# EAGLE design PiSpi (EAGLE 6.4)
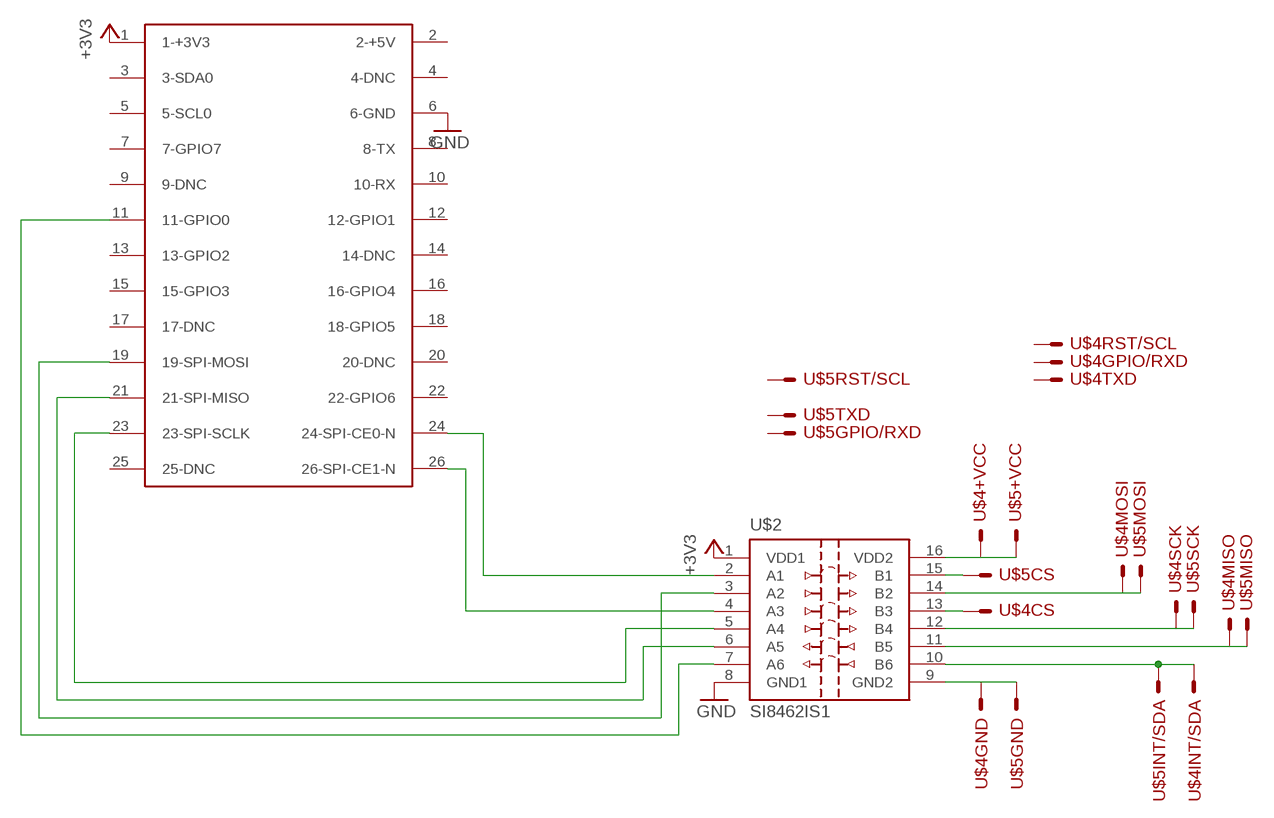
[diagram p0: schematic, sheet 1]

## Parts
U$1  RASPBERRY-PI  [RASPBERRY-PI]
U$2  SI8462IS1  [SO16]
U$4  SPI_BUS2  [SPI_BUS2]
U$5  SPI_BUS2  [SPI_BUS2]

## Nets
+3V3: U$1.1(1-+3V3) U$2.1(VDD1)
GND: U$1.6(6-GND) U$2.8(GND1)
GND1: U$2.9(GND2) U$4.GND U$5.GND
N$1: U$1.24(24-SPI-CE0-N) U$2.2(A1)
N$2: U$2.14(B2) U$4.MOSI U$5.MOSI
N$3: U$2.13(B3) U$4.CS
N$4: U$2.12(B4) U$4.SCK U$5.SCK
N$5: U$2.11(B5) U$4.MISO U$5.MISO
N$6: U$2.15(B1) U$5.CS
N$7: U$1.11(11-GPIO0) U$2.7(A6)
N$8: U$2.10(B6) U$4.INT/SDA U$5.INT/SDA
N$15: U$1.26(26-SPI-CE1-N) U$2.4(A3)
N$17: U$1.23(23-SPI-SCLK) U$2.5(A4)
N$18: U$1.21(21-SPI-MISO) U$2.6(A5)
N$19: U$1.19(19-SPI-MOSI) U$2.3(A2)
N$32: U$2.16(VDD2) U$4.+VCC U$5.+VCC
Unconnected: U$1.2(2-+5V) U$1.3(3-SDA0) U$1.4(4-DNC) U$1.5(5-SCL0) U$1.7(7-GPIO7) U$1.8(8-TX) U$1.9(9-DNC) U$1.10(10-RX) U$1.12(12-GPIO1) U$1.13(13-GPIO2) U$1.14(14-DNC) U$1.15(15-GPIO3) U$1.16(16-GPIO4) U$1.17(17-DNC) U$1.18(18-GPIO5) U$1.20(20-DNC) U$1.22(22-GPIO6) U$1.25(25-DNC) U$4.GPIO/RXD U$4.RST/SCL U$4.TXD U$5.GPIO/RXD U$5.RST/SCL U$5.TXD

## Library data of the parts
U$1 = lieven:RASPBERRY-PI: Raspberry Pi Board <http://www.raspberrypi.org/> Jacques Lagnel V1.0 (beta) 2012 Board dimension: Forum 3D model <http://www.raspberrypi.org/forum/general-discussion/mechanical-profile-3d-models?value=3d%20model&type=1&include=1&search=1&ret=all> The GPIO Connector (P1): http://elinux.org/RPi_Low-level_peripherals
U$2 = silicon-labs:SI8462: Si8462 6 Channel (4/2) Digital Isolator Silicon Labs Si84xx ISOpro digital isolator series. The Si84xx ISOpro digital isolators provide low power galvanic isolation for digital signals. They come in speeds of 1Mbps and 150Mbps, and isolation ratings of 1KV, 2.5KV and 5KV. The independent sides use 2.7-5.5V supplies and draw under 5mA per channel. Donald Becker
U$4 U$5 = lieven:SPI_BUS2

## Board
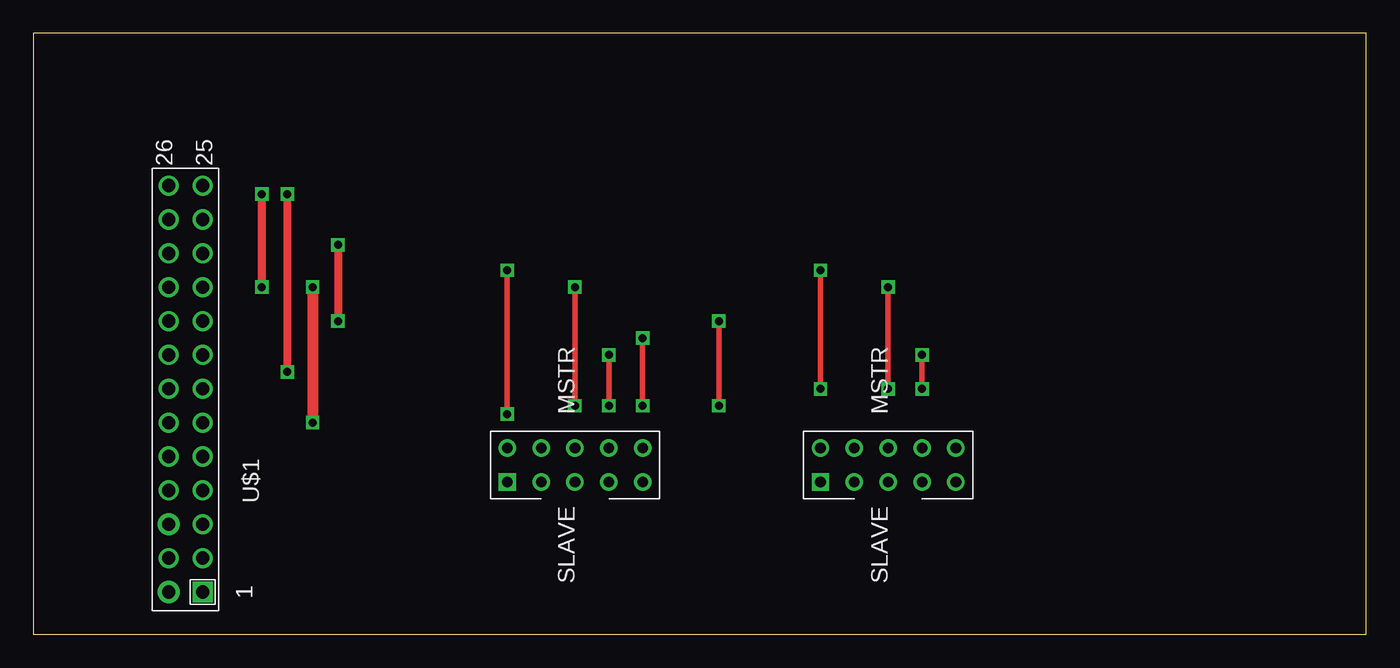
[diagram p1: board, top side]
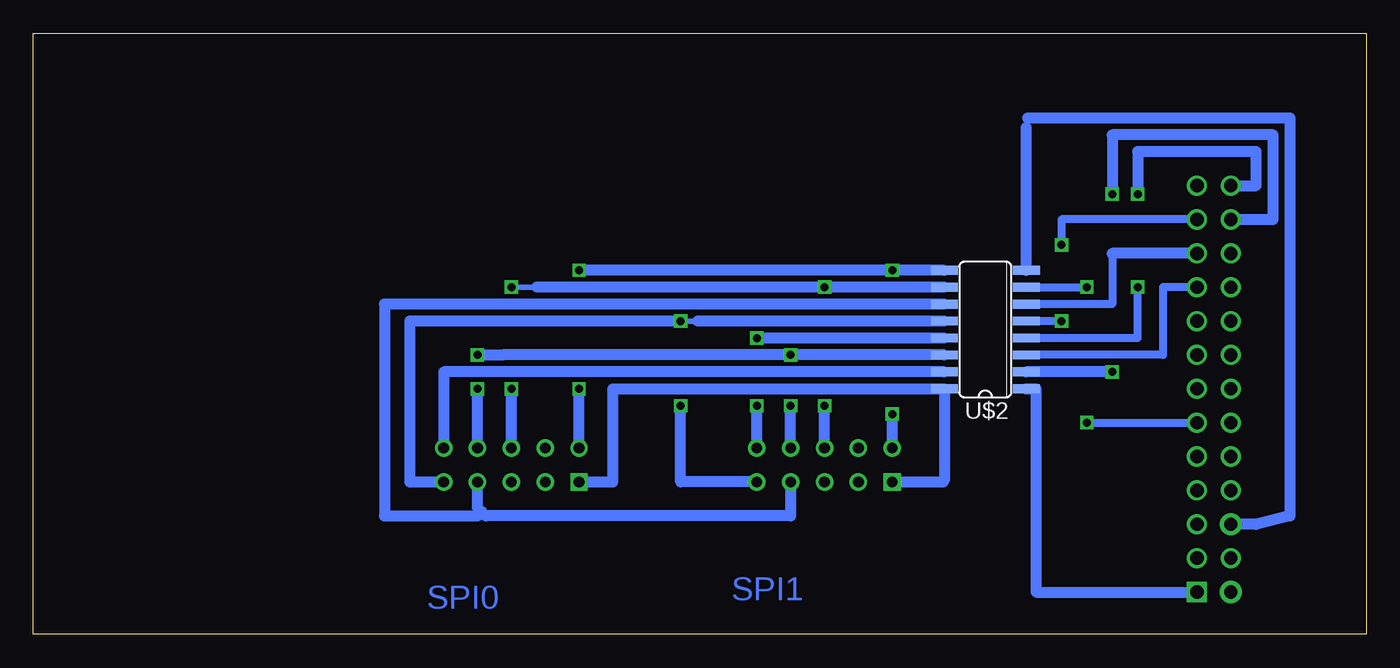
[diagram p2: board, bottom side, seen from below]

Size 100 x 45.08 mm. Coordinates in mm from the lower left corner, seen from the top.
Outline: 0,0 100,0 100,45.08 0,45.08 0,0
Copper layers (1*16): Top 0.035mm / dielectric 1.5mm / Bottom 0.035mm
Design rules "default": minimum track width 10mil, minimum drill 24mil, track to track 8mil, track to pad 8mil, pad to pad 8mil, via to via 8mil, smd to smd 8mil, copper to edge 40mil, drill to drill 8mil, minimum pad ring 10mil, minimum via ring 8mil, stop-mask expansion 4mil, vias tented up to drill 0mil, thermal gap 10mil

### Footprints (pad centres in the part's own frame; a part is rotated, then mirrored left to right if it is on the bottom)
RASPBERRY-PI = drill 1 square: 1 0,0 | drill 1 pad 1.676: 2 0,2.54; 6 5.08,2.54 | drill 1: 3 2.54,0; 4 2.54,2.54; 5 5.08,0; 7 7.62,0; 8 7.62,2.54; 9 10.16,0; 10 10.16,2.54; 11 12.7,0; 12 12.7,2.54; 13 15.24,0; 14 15.24,2.54; 15 17.78,0; 16 17.78,2.54; 17 20.32,0; 18 20.32,2.54; 19 22.86,0; 20 22.86,2.54; 21 25.4,0; 22 25.4,2.54; 23 27.94,0; 24 27.94,2.54; 25 30.48,0; 26 30.48,2.54
SO16 = smd 0.66 x 2.032: 1 -4.445,-3.073; 2 -3.175,-3.073; 3 -1.905,-3.073; 4 -0.635,-3.073; 5 0.635,-3.073; 6 1.905,-3.073; 7 3.175,-3.073; 8 4.445,-3.073; 9 4.445,3.073; 10 3.175,3.073; 11 1.905,3.073; 12 0.635,3.073; 13 -0.635,3.073; 14 -1.905,3.073; 15 -3.175,3.073; 16 -4.445,3.073
SPI_BUS2 = drill 0.8 square: +VCC 0,10.16 | drill 0.8: CS 2.54,0; GND 2.54,10.16; GPIO/RXD 2.54,7.62; INT/SDA 2.54,5.08; MISO 0,2.54; MOSI 2.54,2.54; RST/SCL 0,5.08; SCK 0,0; TXD 0,7.62

### Placement (x,y rotation side)
U$1  12.7,3.17 90 top
U$2  28.57,22.86 90 bottom
U$4  45.72,11.43 90 top
U$5  69.22,11.43 90 top

### Tracks (layer width: path | path; a pad name or v marks a point on that pad's centre or on a via)
+3V3
  Bottom 0.813: U$2.1 24.77,18.41 24.77,3.17 U$1.1
GND
  Bottom 0.406: 25.5,38 25.4,38.73
  Bottom 0.813: U$2.8 25.5,38 | 25.4,38.73 5.71,38.73 5.71,8.89 8.26,8.26 U$1.6
GND1  (via drill 0.6)
  Top 0.406: v59.05,18.41 v59.05,27.3 | v35.56,16.51 v35.56,27.3
  Bottom 0.813: U$2.9 v35.56,27.3 v59.05,27.3 | U$4.GND v35.56,16.51 | U$5.GND v59.05,18.41
N$1  (via drill 0.6)
  Top 0.61: v19.05,33.02 v19.05,19.68
  Bottom 0.813: U$1.24 6.99,31.11 6.99,37.47 19.05,37.47 v19.05,33.02 | v19.05,19.68 U$2.2
N$2  (via drill 0.6)
  Top 0.406: v43.18,17.14 v43.18,20.95 | v66.67,18.41 v66.67,20.95
  Bottom 0.813: U$2.14 v43.18,20.95 64.77,20.95 v66.67,20.95 | U$5.MOSI v66.67,18.41 | U$4.MOSI v43.18,17.14
N$3  (via drill 0.6)
  Top 0.406: v45.72,17.14 v45.72,22.23
  Bottom 0.406: v45.72,22.23 45.09,22.23
  Bottom 0.813: U$2.13 45.09,22.23 | U$4.CS v45.72,17.14
N$4  (via drill 0.6)
  Top 0.406: v51.44,17.14 v51.44,23.5
  Bottom 0.406: v51.44,23.5 50.16,23.5
  Bottom 0.813: U$2.12 50.16,23.5 | v51.44,23.5 71.75,23.5 71.75,11.43 U$5.SCK | U$4.SCK 51.44,11.43 v51.44,17.14
N$5
  Bottom 0.406: 66.04,8.89 66.36,9.21 66.67,9.53
  Bottom 0.813: U$4.MISO 43.18,8.89 66.04,8.89 | 66.67,9.53 U$5.MISO | U$2.11 73.66,24.77 73.66,8.89 66.67,8.89 66.36,9.21
N$6
  Bottom 0.813: U$2.15 69.22,19.68 U$5.CS
N$7  (via drill 0.6)
  Top 0.813: v20.95,26.04 v20.95,15.88
  Bottom 0.61: U$2.7 v20.95,26.04 | v20.95,15.88 U$1.11
N$8  (via drill 0.6)
  Top 0.406: v40.64,17.14 v40.64,26.04 | v64.14,18.41 v64.14,26.04
  Bottom 0.406: v64.14,26.04 62.23,26.04
  Bottom 0.813: U$2.10 v40.64,26.04 62.23,26.04 | U$5.INT/SDA v64.14,18.41 | U$4.INT/SDA v40.64,17.14
N$15  (via drill 0.6)
  Top 0.61: v17.14,33.02 v17.14,26.04
  Bottom 0.61: U$2.4 17.14,22.23 v17.14,26.04
  Bottom 0.813: U$1.26 8.26,33.66 8.26,36.2 17.14,36.2 v17.14,33.02
N$17  (via drill 0.6)
  Top 0.61: v22.86,29.21 v22.86,23.5
  Bottom 0.61: U$1.23 22.86,31.11 v22.86,29.21 | v22.86,23.5 U$2.5
N$18
  Bottom 0.61: 19.05,28.57 19.05,24.77 U$2.6
  Bottom 0.813: U$1.21 19.05,28.57
N$19
  Bottom 0.406: U$2.3 21.59,20.95
  Bottom 0.61: U$1.19 15.24,26.04 15.24,20.95 U$2.3
N$32
  Bottom 0.406: 31.65,11.53 31.75,11.43
  Bottom 0.813: 31.65,11.53 U$2.16 56.52,18.41 56.52,11.43 U$5.+VCC | U$4.+VCC 31.75,11.43

### Text on the board
Bottom: SPI1 | SPI0